# EAGLE schematic invamp (EAGLE 6.5.0)
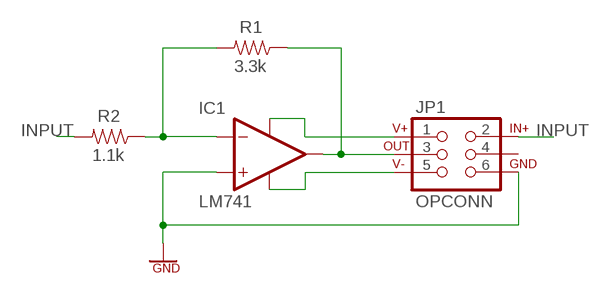
[diagram p0: schematic, sheet 1]

## Parts
IC1  LM741  [SO08]
JP1  OPCONN  [2X3]
R1  3.3k  RES_0603  [SMD0603]
R2  1.1k  RES_0603  [SMD0603]

## Nets
GND: IC1.3(IN+) JP1.6
INPUT: JP1.2 R2.2
N$1: IC1.6(OUT) JP1.3 R1.1
N$2: IC1.2(IN-) R1.2 R2.1
N$3: IC1.7(V+) JP1.1
N$4: IC1.4(V-) JP1.5
Unconnected: JP1.4

## Library data of the parts
IC1 = eagle-book:LM741: LM741 Operational Amplifier
JP1 = eagle-book:OPCONN: 6-pin connector for the op-amp circuit
R1 R2 = eagle-book:RES: Resistor